# EAGLE design time_circuit_controller_1.1 (EAGLE 9.6.2)

## Sheet 1 of 2
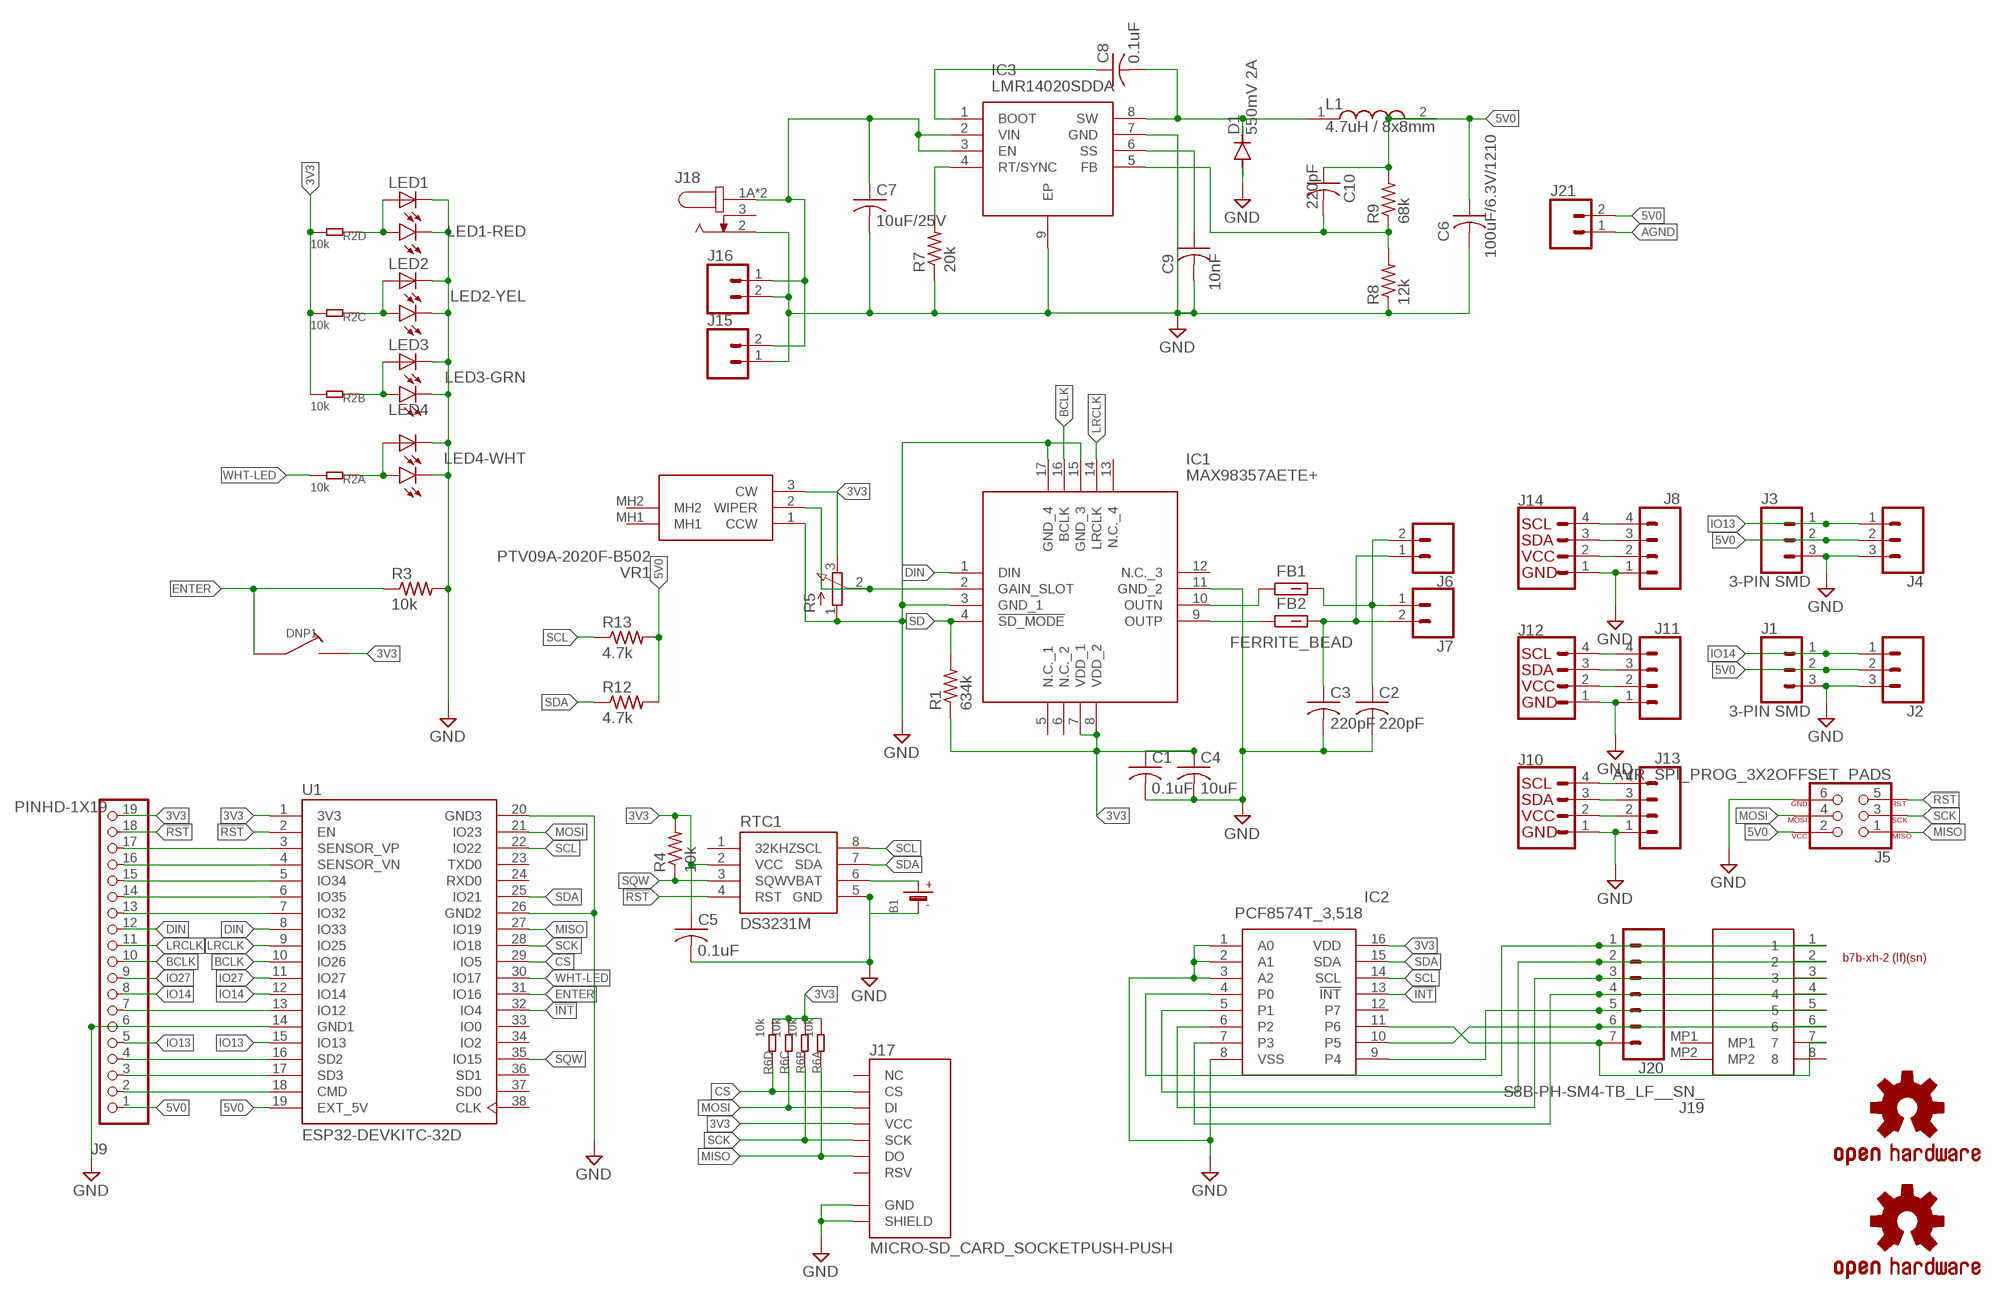
[diagram p0: schematic, sheet 1]

### Parts
B1  BATTERYCR2032_BAT-HLD-001  [CR2032_SMT_BAT-HLD-001]
C1  0.1uF  C-USC0603  [C0603]
C2  220pF  C-USC0603  [C0603]
C3  220pF  C-USC0603  [C0603]
C4  10uF  C-USC0603  [C0603]
C5  0.1uF  C-USC0603  [C0603]
C6  100uF/6.3V/1210  C-USC1210  [C1210]
C7  10uF/25V  C-USC0805  [C0805]
C8  0.1uF  C-USC0603  [C0603]
C9  10nF  C-USC0603  [C0603]
C10  220pF  C-USC0603  [C0603]
D1  550mV 2A  DIODE-DO214AC  [DO214AC]
DNP1  SWITCH-PINHEAD  [PIN-1X2-3.5MM]
FB1  FERRITE_BEAD  FBCHIP-0603(1608-METRIC)  [BEADC1608X95N]
FB2  FERRITE_BEAD  FBCHIP-0603(1608-METRIC)  [BEADC1608X95N]
IC1  MAX98357AETE+  [QFN50P300X300X80-17N]
IC2  PCF8574T_3,518  [SOIC127P1032X265-16N]
IC3  LMR14020SDDA  [SOIC127P600X170-9N]
J1  3-PIN SMD  CONN_03JST-SMD  [JST-3-SMD]
J2  CONN_03LOCK_LONGPADS  [1X03_LOCK_LONGPADS]
J3  3-PIN SMD  CONN_03JST-SMD  [JST-3-SMD]
J4  CONN_03LOCK_LONGPADS  [1X03_LOCK_LONGPADS]
J5  AVR_SPI_PROG_3X2OFFSET_PADS  [2X3_OFFSET]
J6  CONN_02-JST-2MM-SMT  [JST-2-SMD]
J7  CONN_02  [1X02]
J8  CONN_04SMD_2.54  [1X04_5.5MM_STRAIGHT]
J9  PINHD-1X19  [1X19]
J10  I2C_STANDARD  [1X04]
J11  CONN_04SMD_2.54  [1X04_5.5MM_STRAIGHT]
J12  I2C_STANDARD  [1X04]
J13  CONN_04SMD_2.54  [1X04_5.5MM_STRAIGHT]
J14  I2C_STANDARD  [1X04]
J15  CONN_023.5MM  [SCREWTERMINAL-3.5MM-2]
J16  CONN_02-JST-2MM-SMT  [JST-2-SMD]
J17  MICRO-SD_CARD_SOCKETPUSH-PUSH  [MICRO-SD-SOCKET]
J18  9-12VAC  PJ-002AH-SMT-TR  [CUI_PJ-002AH-SMT-TR]
J19  S8B-PH-SM4-TB_LF__SN_  [S8BPHSM4TBLFSN]
J20  CONN_07LOCK  [1X07_LOCK]
J21  CONN_023.5MM  [SCREWTERMINAL-3.5MM-2]
L1  4.7uH / 8x8mm  1273AS-H-3R3N=P3  [INDPM8082X300N]
LED1  LEDCHIPLED_1206  [CHIPLED_1206]
LED1-RED  LED5MM  [LED5MM]
LED2  LEDCHIPLED_1206  [CHIPLED_1206]
LED2-YEL  LED5MM  [LED5MM]
LED3  LEDCHIPLED_1206  [CHIPLED_1206]
LED3-GRN  LED5MM  [LED5MM]
LED4  LEDCHIPLED_1206  [CHIPLED_1206]
LED4-WHT  LED5MM  [LED5MM]
LOGO1  OSHW-LOGOL  [OSHW-LOGO-L]
LOGO2  OSHW-LOGOL  [OSHW-LOGO-L]
R1  634k  R-US_R0603  [R0603]
R2  10k  RES-ARRAY-1206  [RA1206-8]
R3  10k  R-US_R0603  [R0603]
R4  10k  R-US_R0603  [R0603]
R5  3RP/1610N  [3RP/1610N]
R6  10k  RES-ARRAY-1206  [RA1206-8]
R7  20k  R-US_R0603  [R0603]
R8  12k  R-US_R0603  [R0603]
R9  68k  R-US_R0603  [R0603]
R12  4.7k  R-US_R0603  [R0603]
R13  4.7k  R-US_R0603  [R0603]
RTC1  DS3231M  [SO08]
U1  ESP32-DEVKITC-32D  [MODULE_ESP32-DEVKITC-32D]
VR1  PTV09A-2020F-B502  [PTV09A2020FB502]

### Nets
3V3: C1.1 C4.1 C5.1 DNP1.P$2 IC1.7(VDD_1) IC1.8(VDD_2) IC2.16(VDD) J9.19 J17.VCC R1.1 R2.2 R2.3 R2.4 R4.2 R5.3(E) R6.1 R6.2 R6.3 R6.4 RTC1.2(VCC) U1.1(3V3) VR1.3(CW)
5V0: C6.1 C10.1 J1.2 J2.2 J3.2 J4.2 J5.2 J8.2 J9.1 J10.2 J11.2 J12.2 J13.2 J14.2 J21.2 L1.2 R9.2 R12.2 R13.2 U1.19(EXT_5V)
!INT: IC2.13(!INT) U1.32(IO4)
!RST: J5.5 J9.18 RTC1.4(RST) U1.2(EN)
AGND: B1.- C1.2 C2.2 C3.2 C4.2 C5.2 C6.2 C7.2 C9.2 D1.A IC1.3(GND_1) IC1.11(GND_2) IC1.15(GND_3) IC1.17(GND_4) IC2.1(A0) IC2.2(A1) IC2.3(A2) IC2.8(VSS) IC3.7(GND) IC3.9(EP) J1.3 J2.3 J3.3 J4.3 J5.6 J8.1 J9.6 J10.1 J11.1 J12.1 J13.1 J14.1 J15.1 J16.2 J17.CD1(SHIELD) J17.GND J18.2 J21.1 LED1-RED.K(C) LED1.C LED2-YEL.K(C) LED2.C LED3-GRN.K(C) LED3.C LED4-WHT.K(C) LED4.C R3.2 R5.1(A) R7.1 R8.1 RTC1.5(GND) U1.14(GND1) U1.20(GND3) U1.26(GND2) VR1.1(CCW) ; supply symbol labelled GND
BCLK: IC1.16(BCLK) J9.10 U1.10(IO26)
BOOT1: C8.1 IC3.1(BOOT)
CS: J17.CS R6.5 U1.29(IO5)
DIN: IC1.1(DIN) J9.12 U1.8(IO33)
ENTER: DNP1.P$1 R3.1 U1.31(IO16)
FB1: C10.2 IC3.5(FB) R8.2 R9.1
IO13: J3.1 J4.1 J9.5 U1.15(IO13)
IO14: J1.1 J2.1 J9.8 U1.12(IO14)
IO27: J9.9 U1.11(IO27)
LRCLK: IC1.14(LRCLK) J9.11 U1.9(IO25)
MISO: J5.1 J17.DO R6.8 U1.27(IO19)
MOSI: J5.4 J17.DI R6.6 U1.21(IO23)
N$1: IC2.11(P6) J19.7 J20.7
N$2: FB1.1 IC1.10(OUTN)
N$3: B1.+$1(+) B1.+$2(+) RTC1.6(VBAT)
N$4: IC2.4(P0) J19.1 J20.1
N$5: IC2.9(P4) J19.5 J20.5
N$6: J9.15 U1.5(IO34)
N$7: C2.1 FB1.2 J6.2 J7.1
N$8: FB2.1 IC1.9(OUTP)
N$9: C3.1 FB2.2 J6.1 J7.2
N$10: LED1-RED.A LED1.A R2.5
N$11: LED2-YEL.A LED2.A R2.6
N$12: IC2.5(P1) J19.2 J20.2
N$13: LED3-GRN.A LED3.A R2.7
N$14: IC2.6(P2) J19.3 J20.3
N$15: LED4-WHT.A LED4.A R2.8
N$16: IC2.7(P3) J19.4 J20.4
N$17: J9.14 U1.6(IO35)
N$18: IC2.10(P5) J19.6 J20.6
N$19: IC1.2(GAIN_SLOT) R5.2(S) VR1.2(WIPER)
N$20: J9.13 U1.7(IO32)
N$21: J9.16 U1.4(SENSOR_VN)
N$22: J9.17 U1.3(SENSOR_VP)
N$23: J9.7 U1.13(IO12)
N$24: J9.4 U1.16(SD2)
N$25: J9.3 U1.17(SD3)
N$26: J9.2 U1.18(CMD)
RT1: IC3.4(RT/SYNC) R7.2
SCK: J5.3 J17.SCLK(SCK) R6.7 U1.28(IO18)
SCL: IC2.14(SCL) J8.4 J10.4 J11.4 J12.4 J13.4 J14.4 R13.1 RTC1.8(SCL) U1.22(IO22)
SD: IC1.4(!SD_MODE) R1.2
SDA: IC2.15(SDA) J8.3 J10.3 J11.3 J12.3 J13.3 J14.3 R12.1 RTC1.7(SDA) U1.25(IO21)
SQW: R4.1 RTC1.3(SQW) U1.35(IO15)
SS1: C9.1 IC3.6(SS)
SW1: C8.2 D1.C IC3.8(SW) L1.1
VIN1: C7.1 IC3.2(VIN) IC3.3(EN) J15.2 J16.1 J18.1A J18.1B
WHT-LED: R2.1 U1.30(IO17)
Unconnected: IC1.5(N.C._1) IC1.6(N.C._2) IC1.12(N.C._3) IC1.13(N.C._4) IC2.12(P7) J17.RSV1(RSV) J17.RSV2(NC) J18.3 J19.8 J19.MP1 J19.MP2 RTC1.1(32KHZ) U1.23(TXD0) U1.24(RXD0) U1.33(IO0) U1.34(IO2) U1.36(SD1) U1.37(SD0) U1.38(CLK) VR1.MH1 VR1.MH2

### Notes on the sheet
- b7b-xh-2 (lf)(sn)

## Sheet 2 of 2

## Library data of the parts
B1 = Fidget Spinner Example:BATTERY: CR1220 SMT - Digikey: 3001K-ND CD2032 BAT-HLD-001 - Digikey: BAT-HLD-001-ND
C1-C10 = rcl:C-US: CAPACITOR, American symbol; SPICEPREFIX: C
D1 = diode:DIODE-: DIODE
DNP1 = adam - mechanical:SWITCH-PINHEAD
FB1 FB2 = Filter:FB: Ferrite Bead - Generic; CATEGORY: Filter; SUB-CATEGORY: Ferrite bead
IC1 = SamacSys_Parts:MAX98357AETE+: MAXIM INTEGRATED PRODUCTS - MAX98357AETE+ - AMPLIFIER, CLASS-D, 1-CH, 3.2W, TQFN-16 Source: Datasheet; DESCRIPTION: MAXIM INTEGRATED PRODUCTS - MAX98357AETE+ - AMPLIFIER, CLASS-D, 1-CH, 3.2W, TQFN-16; HEIGHT: 0.8mm; MANUFACTURER_NAME: Maxim Integrated; MANUFACTURER_PART_NUMBER: MAX98357AETE+; MOUSER_PART_NUMBER: 700-MAX98357AETE+; MOUSER_PRICE-STOCK: https://www.mouser.co.uk/ProductDetail/Maxim-Integrated/MAX98357AETE%2b?qs=AAveGqk956EyS6m3AmZeuw%3D%3D
IC2 = SamacSys_Parts:PCF8574T_3,518: NXP - PCF8574T/3,518 - IC, I/O EXPANDER, 8BIT, SOIC16 Source: Datasheet; ARROW_PART_NUMBER: PCF8574T/3,518; ARROW_PRICE-STOCK: https://www.arrow.com/en/products/pcf8574t3518/nxp-semiconductors; DESCRIPTION: NXP - PCF8574T/3,518 - IC, I/O EXPANDER, 8BIT, SOIC16; HEIGHT: 2.65mm; MANUFACTURER_NAME: NXP; MANUFACTURER_PART_NUMBER: PCF8574T/3,518; MOUSER_PART_NUMBER: 771-PCF8574TD-T; MOUSER_PRICE-STOCK: https://www.mouser.co.uk/ProductDetail/NXP-Semiconductors/PCF8574T-3518?qs=LOCUfHb8d9srwcgHHpXqQw%3D%3D
IC3 = SamacSys_Parts:LMR14020SDDA: Voltage Regulators - Switching Regulators 40V 2A 2.2Mhz Simple Switcher Source: Datasheet; DESCRIPTION: Voltage Regulators - Switching Regulators 40V 2A 2.2Mhz Simple Switcher; HEIGHT: 1.7mm; MANUFACTURER_NAME: Texas Instruments; MANUFACTURER_PART_NUMBER: LMR14020SDDA; MOUSER_PART_NUMBER: 595-LMR14020SDDA; MOUSER_PRICE-STOCK: https://www.mouser.com/Search/Refine.aspx?Keyword=595-LMR14020SDDA; RS_PART_NUMBER: 1629813; RS_PRICE-STOCK: http://uk.rs-online.com/web/p/products/1629813
J1 J3 = SparkFun-Connectors:CONN_03: Multi connection point. Often used as Generic Header-pin footprint for 0.1 inch spaced/style header connections On any of the 0.1 inch spaced packages, you can populate with these: Break Away Headers - Straight (PRT-00116) Break Away Male Headers - Right Angle (PRT-00553) Female Headers (PRT-00115) Break Away Headers - Machine Pin (PRT-00117) Break Away Female Headers - Swiss Machine Pin (PRT-00743) Stackable Header - 3 Pin (Female, 0.1") (PRT-13875) For SCREWTERMINALS and SPRING TERMINALS visit here: Screw Terimnals on SparkFun.com (5mm/3.5mm/2.54mm spacing) This device is also useful as a general connection point to wire up your design to another part of your project. Our various solder wires solder well into these plated through hole pads. Hook-Up Wire - Assortment (Stranded, 22 AWG) (PRT-11375) Hook-Up Wire - Assortment (Solid Core, 22 AWG) (PRT-11367) View the entire wire category on our website here Special notes: Molex polarized connector foot print use with SKU : PRT-08232 with associated crimp pins and housings.; PROD_ID: CONN-12591
J2 J4 = SparkFun-Connectors:CONN_03: Multi connection point. Often used as Generic Header-pin footprint for 0.1 inch spaced/style header connections On any of the 0.1 inch spaced packages, you can populate with these: Break Away Headers - Straight (PRT-00116) Break Away Male Headers - Right Angle (PRT-00553) Female Headers (PRT-00115) Break Away Headers - Machine Pin (PRT-00117) Break Away Female Headers - Swiss Machine Pin (PRT-00743) Stackable Header - 3 Pin (Female, 0.1") (PRT-13875) For SCREWTERMINALS and SPRING TERMINALS visit here: Screw Terimnals on SparkFun.com (5mm/3.5mm/2.54mm spacing) This device is also useful as a general connection point to wire up your design to another part of your project. Our various solder wires solder well into these plated through hole pads. Hook-Up Wire - Assortment (Stranded, 22 AWG) (PRT-11375) Hook-Up Wire - Assortment (Solid Core, 22 AWG) (PRT-11367) View the entire wire category on our website here Special notes: Molex polarized connector foot print use with SKU : PRT-08232 with associated crimp pins and housings.
J5 = SparkFun-Connectors:AVR_SPI_PROG_3X2: AVR ISP 6 Pin This is the reduced ISP connector for AVR programming. Common on Arduino. This footprint will take up less PCB space and can be used with a 10-pin to 6-pin adapter such as SKU: BOB-08508 **Special note about "TEST_POINT" package. The stop mask is on the top side, so if you want your programming test points to be on the bottom of your board, make sure to place this package on the bottom side of the board. This also ensure that the orientation to program from the bottom side will be correct. SparkFun Products: SparkFun ISP Pogo Adapter - NS Tiny AVR Programmer -PTH
J6 J16 = SparkFun-Connectors:CONN_02: Multi connection point. Often used as Generic Header-pin footprint for 0.1 inch spaced/style header connections On any of the 0.1 inch spaced packages, you can populate with these: Break Away Headers - Straight (PRT-00116) Break Away Male Headers - Right Angle (PRT-00553) Female Headers (PRT-00115) Break Away Headers - Machine Pin (PRT-00117) Break Away Female Headers - Swiss Machine Pin (PRT-00743) For SCREWTERMINALS and SPRING TERMINALS visit here: Screw Terimnals on SparkFun.com (5mm/3.5mm/2.54mm spacing) This device is also useful as a general connection point to wire up your design to another part of your project. Our various solder wires solder well into these plated through hole pads. Hook-Up Wire - Assortment (Stranded, 22 AWG) (PRT-11375) Hook-Up Wire - Assortment (Solid Core, 22 AWG) (PRT-11367) View the entire wire category on our website here Special notes: Molex polarized connector foot print use with: PRT-08233 with associated crimp pins and housings. 2.54_SCREWTERM for use with PRT-10571. 3.5mm Screw Terminal footprints for PRT-08084 5mm Screw Terminal footprints for use with PRT-08432; PROD_ID: CONN-11443
J7 = SparkFun-Connectors:CONN_02: Multi connection point. Often used as Generic Header-pin footprint for 0.1 inch spaced/style header connections On any of the 0.1 inch spaced packages, you can populate with these: Break Away Headers - Straight (PRT-00116) Break Away Male Headers - Right Angle (PRT-00553) Female Headers (PRT-00115) Break Away Headers - Machine Pin (PRT-00117) Break Away Female Headers - Swiss Machine Pin (PRT-00743) For SCREWTERMINALS and SPRING TERMINALS visit here: Screw Terimnals on SparkFun.com (5mm/3.5mm/2.54mm spacing) This device is also useful as a general connection point to wire up your design to another part of your project. Our various solder wires solder well into these plated through hole pads. Hook-Up Wire - Assortment (Stranded, 22 AWG) (PRT-11375) Hook-Up Wire - Assortment (Solid Core, 22 AWG) (PRT-11367) View the entire wire category on our website here Special notes: Molex polarized connector foot print use with: PRT-08233 with associated crimp pins and housings. 2.54_SCREWTERM for use with PRT-10571. 3.5mm Screw Terminal footprints for PRT-08084 5mm Screw Terminal footprints for use with PRT-08432
J8 J11 J13 = SparkFun-Connectors:CONN_04: Multi connection point. Often used as Generic Header-pin footprint for 0.1 inch spaced/style header connections On any of the 0.1 inch spaced packages, you can populate with these: Break Away Headers - Straight (PRT-00116) Break Away Male Headers - Right Angle (PRT-00553) Female Headers (PRT-00115) Break Away Headers - Machine Pin (PRT-00117) Break Away Female Headers - Swiss Machine Pin (PRT-00743) For SCREWTERMINALS and SPRING TERMINALS visit here: Screw Terimnals on SparkFun.com (5mm/3.5mm/2.54mm spacing) This device is also useful as a general connection point to wire up your design to another part of your project. Our various solder wires solder well into these plated through hole pads. Hook-Up Wire - Assortment (Stranded, 22 AWG) (PRT-11375) Hook-Up Wire - Assortment (Solid Core, 22 AWG) (PRT-11367) View the entire wire category on our website here Special notes: Molex polarized connector foot print use with SKU : PRT-08231 with associated crimp pins and housings. 1MM SMD Version SKU: PRT-10208
J9 = adafruit:PINHD-1X19
J10 J12 J14 = SparkFun-Connectors:I2C_STANDARD: SparkFun I2C Standard Pinout Header SparkFun has standardized on a pinout for all I2C based sensor breakouts. This pinout allows I2C boards to be plugged directly into the headers on Arduino Uno compatible boards, and to be daisy chained easily. Example SparkFun Products: SparkFun Atmospheric Sensor Breakout - BME280 <https://www.sparkfun.com/products/13676> SparkFun Altitude/Pressure Sensor Breakout - MPL3115A2 <https://www.sparkfun.com/products/11084> SparkFun TOF Range Finder Sensor - VL6180 <https://www.sparkfun.com/products/12785>
J15 J21 = SparkFun-Connectors:CONN_02: Multi connection point. Often used as Generic Header-pin footprint for 0.1 inch spaced/style header connections On any of the 0.1 inch spaced packages, you can populate with these: Break Away Headers - Straight (PRT-00116) Break Away Male Headers - Right Angle (PRT-00553) Female Headers (PRT-00115) Break Away Headers - Machine Pin (PRT-00117) Break Away Female Headers - Swiss Machine Pin (PRT-00743) For SCREWTERMINALS and SPRING TERMINALS visit here: Screw Terimnals on SparkFun.com (5mm/3.5mm/2.54mm spacing) This device is also useful as a general connection point to wire up your design to another part of your project. Our various solder wires solder well into these plated through hole pads. Hook-Up Wire - Assortment (Stranded, 22 AWG) (PRT-11375) Hook-Up Wire - Assortment (Solid Core, 22 AWG) (PRT-11367) View the entire wire category on our website here Special notes: Molex polarized connector foot print use with: PRT-08233 with associated crimp pins and housings. 2.54_SCREWTERM for use with PRT-10571. 3.5mm Screw Terminal footprints for PRT-08084 5mm Screw Terminal footprints for use with PRT-08432; PROD_ID: CONN-08399
J17 = SparkFun-Connectors:MICRO-SD_CARD_SOCKET: microSD Socket for Transflash Push-push type µSD socket. tDoc lines correctly indicate media card edge positions when inserting (unlocked, locked, depressed). NOTE: CD1 and CD2 are connected internally, and the default detect state of the socket is detect pin to ground. SparkFun Products: WAV Trigger <https://www.sparkfun.com/products/13660> CAN-Bus Shield <https://www.sparkfun.com/products/13262> SparkFun Level Shifing microSD Breakout <https://www.sparkfun.com/products/13743>; PROD_ID: CONN-07820
J18 = PJ-002AH-SMT-TR:PJ-002AH-SMT-TR: 2.0 mm Center Pin, 5.0 A, Right Angle, Surface Mount (SMT), Dc Power Jack Connector; AVAILABILITY: Good; DESCRIPTION: 24 VDC 5 A Surface Mount Unshielded 2 Conductors 3 Contacts Male Power Jack; MF: CUI; MP: PJ-002AH-SMT-TR; PACKAGE: None; PRICE: 0.88 USD
J19 = SamacSys_Parts:S8B-PH-SM4-TB_LF__SN_: Conn Shrouded Header (4 Sides) HDR 8 POS 2mm Solder RA Side Entry SMD T/R Source: Datasheet; ARROW_PART_NUMBER: S8B-PH-SM4-TB(LF)(SN); ARROW_PRICE-STOCK: https://www.arrow.com/en/products/s8b-ph-sm4-tb-lf-sn/jst-manufacturing; DESCRIPTION: Conn Shrouded Header (4 Sides) HDR 8 POS 2mm Solder RA Side Entry SMD T/R; HEIGHT: 5.5mm; MANUFACTURER_NAME: JST (JAPAN SOLDERLESS TERMINALS); MANUFACTURER_PART_NUMBER: S8B-PH-SM4-TB(LF)(SN)
J20 = SparkFun-Connectors:CONN_07: Multi connection point. Often used as Generic Header-pin footprint for 0.1 inch spaced/style header connections On any of the 0.1 inch spaced packages, you can populate with these: Break Away Headers - Straight (PRT-00116) Break Away Male Headers - Right Angle (PRT-00553) Female Headers (PRT-00115) Break Away Headers - Machine Pin (PRT-00117) Break Away Female Headers - Swiss Machine Pin (PRT-00743) For SCREWTERMINALS and SPRING TERMINALS visit here: Screw Terimnals on SparkFun.com (5mm/3.5mm/2.54mm spacing) This device is also useful as a general connection point to wire up your design to another part of your project. Our various solder wires solder well into these plated through hole pads. Hook-Up Wire - Assortment (Stranded, 22 AWG) (PRT-11375) Hook-Up Wire - Assortment (Solid Core, 22 AWG) (PRT-11367) View the entire wire category on our website here Special notes: Molex polarized connector foot print use with SKU : PRT-08231 with associated crimp pins and housings. 1MM SMD Version SKU: PRT-10208 NOTES ON THE VARIANTS LOCK and LOCK_LONGPADS... This footprint was designed to help hold the alignment of a through-hole component (i.e. 6-pin header) while soldering it into place. You may notice that each hole has been shifted either up or down by 0.005 of an inch from it's more standard position (which is a perfectly straight line). This slight alteration caused the pins (the squares in the middle) to touch the edges of the holes. Because they are alternating, it causes a "brace" to hold the component in place. 0.005 has proven to be the perfect amount of "off-center" position when using our standard breakaway headers. Although looks a little odd when you look at the bare footprint, once you have a header in there, the alteration is very hard to notice. Also,if you push a header all the way into place, it is covered up entirely on the bottom side.
L1 = SamacSys_Parts:1273AS-H-3R3N=P3: Inductor Power Shielded Wirewound 3.3uH 30% 100KHz Ferrite 5.4A 19.2mOhm DCR 3131 T/R Source: Datasheet; DESCRIPTION: Inductor Power Shielded Wirewound 3.3uH 30% 100KHz Ferrite 5.4A 19.2mOhm DCR 3131 T/R; HEIGHT: 3mm; MANUFACTURER_NAME: Murata Electronics; MANUFACTURER_PART_NUMBER: 1273AS-H-3R3N=P3
LED1-LED4 = adafruit:LED: LED
LED1-RED LED2-YEL LED3-GRN LED4-WHT = led:LED: LED
LOGO1 LOGO2 = SparkFun-Aesthetics:OSHW-LOGO: Open-Source Hardware (OSHW) Logo This logo indicates the piece of hardware it is found on incorporates a OSHW license and/or adheres to the definition of open source hardware found here: http://freedomdefined.org/OSHW
R1 R3 R4 R7-R9 R12 R13 = rcl:R-US_: RESISTOR, American symbol; SPICEPREFIX: R
R2 R6 = cap-array:RES-ARRAY: Resistor Array
R5 = pot:3RP/1610N: 16mm Potentiometer one level Source: http://www.alphapotentiometers.net/html/16mm_pot_2.html
RTC1 = SparkFun-Clocks:DS3231M: DS3231M Real Time Clock Accuracy +/-5ppm. Battery Backup. 2.3V to 5.5V. Datasheet SparkFun Products CryptoCape (DEV-12773) SparkFun CryptoShield (DEV-13183); PROD_ID: IC-11985
U1 = ESP32-DEVKITC-32D:ESP32-DEVKITC-32D: Eval Board For Esp-Wroom-32; AVAILABILITY: Unavailable; DESCRIPTION: Eval Board For Esp-Wroom-32; MF: Espressif Systems; MP: ESP32-DEVKITC-32D; PACKAGE: None; PRICE: None
VR1 = SamacSys_Parts:PTV09A-2020F-B502: Potentiometers Source: Datasheet; ARROW_PART_NUMBER: PTV09A-2020F-B502; ARROW_PRICE-STOCK: https://www.arrow.com/en/products/ptv09a-2020f-b502/bourns; DESCRIPTION: Potentiometers; HEIGHT: 15.5mm; MANUFACTURER_NAME: Bourns; MANUFACTURER_PART_NUMBER: PTV09A-2020F-B502; MOUSER_PART_NUMBER: 652-PTV09A-2020FB502; MOUSER_PRICE-STOCK: https://www.mouser.co.uk/ProductDetail/Bourns/PTV09A-2020F-B502?qs=Qzws7J6gxqzi90bdboMV5Q%3D%3D

## Net classes
0 default: width 0.152 mm, drill 0.33 mm, clearance 0.152 mm
1 pwr: width 0.305 mm, drill 0.356 mm, clearance 0.152 mm

## Board
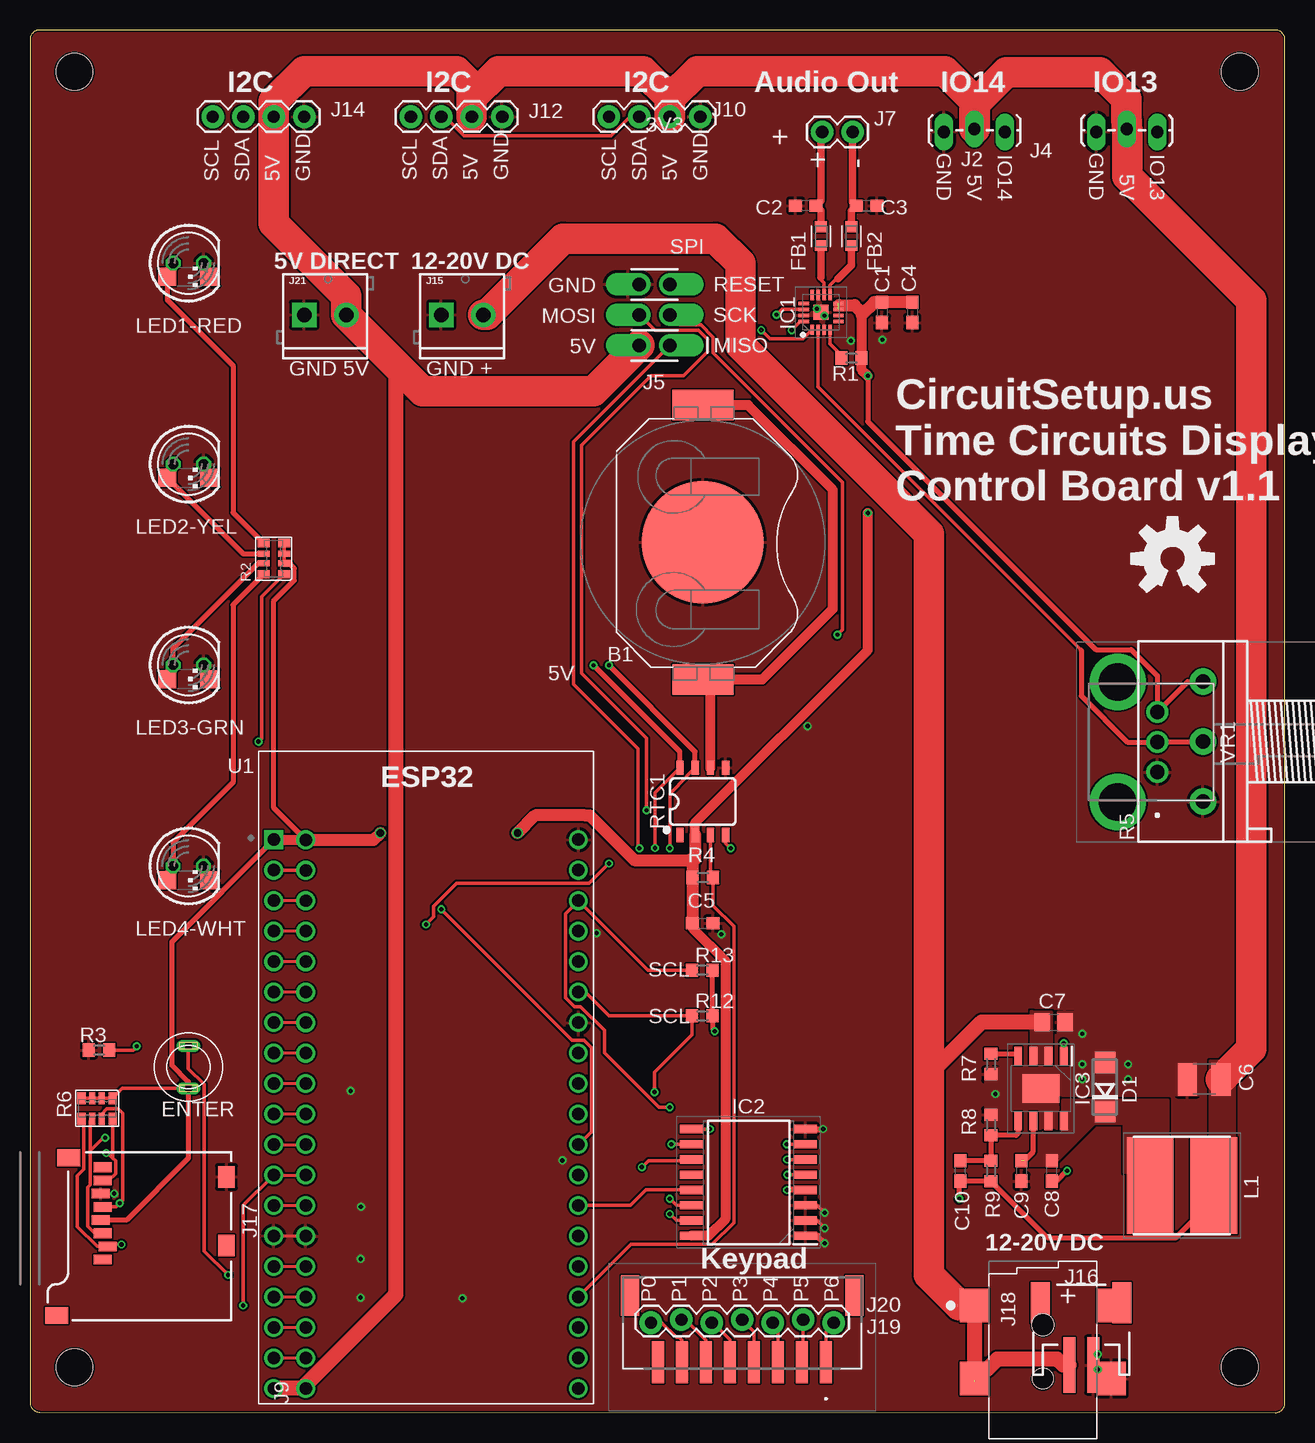
[diagram p1: board, top side]
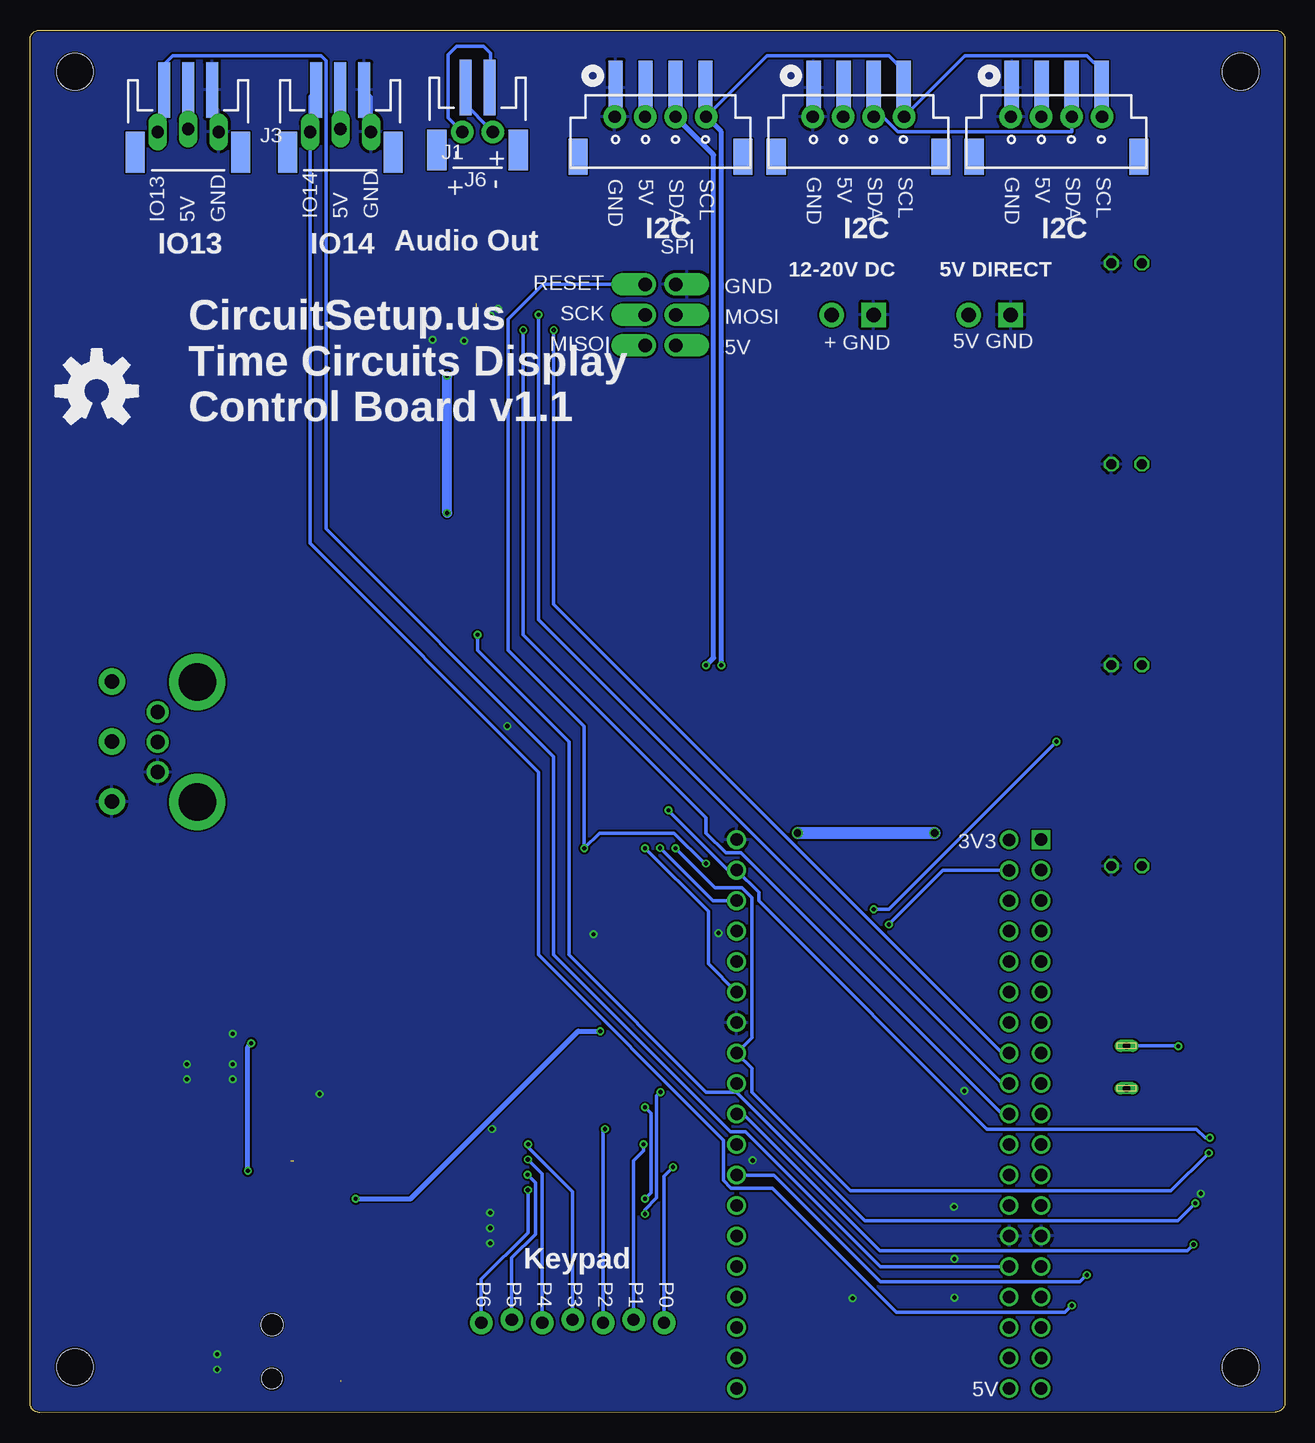
[diagram p2: board, bottom side, seen from below]

Size 104.62 x 115.22 mm. Coordinates in mm from the lower left corner, seen from the top.
Outline: 103.82,0 arc90 104.62,0.8 104.62,28.77 104.62,30.78 104.6,105.68 104.62,109.74 104.62,114.42 arc90 103.82,115.22 0.8,115.22 arc90 0,114.42 0,0.84 arc90 0.8,0.04 103.82,0
Copper layers (1*16): Top 0.035mm / dielectric 1.5mm / Bottom 0.035mm
Design rules "default *": minimum track width 6mil, minimum drill 0.35mm, track to track 6mil, track to pad 6mil, pad to pad 6mil, via to via 6mil, smd to smd 0mil, copper to edge 6mil, drill to drill 6mil, minimum pad ring 8mil, minimum via ring 6mil, stop-mask expansion 4mil, vias tented up to drill 25mil, thermal gap 10mil
Holes 3.05 mm at 3.71,111.75 100.86,111.75 100.86,3.8 3.71,3.78

### Footprints (pad centres in the part's own frame; a part is rotated, then mirrored left to right if it is on the bottom)
CR2032_SMT_BAT-HLD-001 = smd 2.54 x 5.08: +$1 -11.43,0; +$2 11.43,0 | smd 10.16 x 10.16: - 0,0
C0603 = smd 1.1 x 1: 1 -0.85,0; 2 0.85,0
C1210 = smd 1.6 x 2.7: 1 -1.4,0; 2 1.4,0
C0805 = smd 1.3 x 1.5: 1 -0.95,0; 2 0.95,0
DO214AC = smd 1.8 x 1.7: A 2.05,0; C -2.05,0
PIN-1X2-3.5MM = drill 0.6 long: P$1 -1.778,0; P$2 1.778,0
BEADC1608X95N = smd 0.9 x 0.97: 1 -0.785,0 | smd 0.933 x 0.97: 2 0.769,0
QFN50P300X300X80-17N = smd 0.85 x 0.3: 1 -1.45,0.75; 2 -1.45,0.25; 3 -1.45,-0.25; 4 -1.45,-0.75; 9 1.45,-0.75; 10 1.45,-0.25; 11 1.45,0.25; 12 1.45,0.75 | smd 0.3 x 0.85: 5 -0.75,-1.45; 6 -0.25,-1.45; 7 0.25,-1.45; 8 0.75,-1.45; 13 0.75,1.45; 14 0.25,1.45; 15 -0.25,1.45; 16 -0.75,1.45 | smd 1.25 x 1.25: 17 0,0
SOIC127P1032X265-16N = smd 1.95 x 0.7: 1 -4.725,4.445; 2 -4.725,3.175; 3 -4.725,1.905; 4 -4.725,0.635; 5 -4.725,-0.635; 6 -4.725,-1.905; 7 -4.725,-3.175; 8 -4.725,-4.445; 9 4.725,-4.445; 10 4.725,-3.175; 11 4.725,-1.905; 12 4.725,-0.635; 13 4.725,0.635; 14 4.725,1.905; 15 4.725,3.175; 16 4.725,4.445
SOIC127P600X170-9N = smd 1.525 x 0.65: 1 -2.712,1.905; 2 -2.712,0.635; 3 -2.712,-0.635; 4 -2.712,-1.905; 5 2.712,-1.905; 6 2.712,-0.635; 7 2.712,0.635; 8 2.712,1.905 | smd 2.4 x 3.1: 9 0,0
JST-3-SMD = smd 1 x 4.6: 1 2.01,-4.77; 2 0.01,-4.77; 3 -1.99,-4.77 | smd 1.6 x 3.4: NC1 -4.39,0.43; NC2 4.41,0.43
1X03_LOCK_LONGPADS = drill 1.016 long: 1 0,0; 2 2.54,-0.254; 3 5.08,0
2X3_OFFSET = drill 1.118 pad 1.88 offset: 1 -2.54,-1.27; 2 -2.54,1.27; 3 0,-1.27; 4 0,1.27; 5 2.54,-1.27; 6 2.54,1.27
JST-2-SMD = smd 1 x 4.6: 1 -1,-3.7; 2 1,-3.7 | smd 1.6 x 3.4: NC1 -3.4,1.5; NC2 3.4,1.5
1X02 = drill 1.016 pad 1.88: 1 0,0; 2 2.54,0
1X04_5.5MM_STRAIGHT = smd 1.2 x 4.5: 1 -3.737,3.688; 2 -1.238,3.688; 3 1.262,3.688; 4 3.763,3.688 | smd 1.6 x 3: NC1 -6.862,-2.062; NC2 6.875,-2.062
1X19 = drill 1.04: 1 0,0; 2 2.54,0; 3 5.08,0; 4 7.62,0; 5 10.16,0; 6 12.7,0; 7 15.24,0; 8 17.78,0; 9 20.32,0; 10 22.86,0; 11 25.4,0; 12 27.94,0; 13 30.48,0; 14 33.02,0; 15 35.56,0; 16 38.1,0; 17 40.64,0; 18 43.18,0; 19 45.72,0
1X04 = drill 1.016 pad 1.88: 1 0,0; 2 2.54,0; 3 5.08,0; 4 7.62,0
SCREWTERMINAL-3.5MM-2 = drill 1.2 pad 2.032 square: 1 0,0 | drill 1.2 pad 2.032: 2 3.5,0
MICRO-SD-SOCKET = smd 1.8 x 1.4: CD1 -2.05,0.4; CD2 -7.75,0.4 | smd 0.8 x 1.5: CS -7.84,10.3; DI -6.74,10.7; DO -2.34,10.7; GND -3.44,10.9; RSV1 -8.94,10.7; RSV2 -1.24,10.7; SCLK -4.54,10.7; VCC -5.64,10.9 | smd 1.4 x 1.9: GND1 -13.6,14.55; GND3 -0.45,13.55
CUI_PJ-002AH-SMT-TR = smd 2.8 x 2.4: 1A 0,0; 1B -6.1,0; 2 -6.1,-11.4; 3 0,-11.4 | hole 1.7: -6.1,-5.7 | hole 1.8: -1.6,-5.7
S8BPHSM4TBLFSN = smd 1 x 3.5: 1 7,-3.25; 2 5,-3.25; 3 3,-3.25; 4 1,-3.25; 5 -1,-3.25; 6 -3,-3.25; 7 -5,-3.25; 8 -7,-3.25 | smd 1.5 x 3.4: MP1 9.35,2.3; MP2 -9.35,2.3
1X07_LOCK = drill 1.016 pad 1.88: 1 0,0.127; 2 2.54,-0.127; 3 5.08,0.127; 4 7.62,-0.127; 5 10.16,0.127; 6 12.7,-0.127; 7 15.24,0.127
INDPM8082X300N = smd 3.9 x 8.05: 1 -2.65,0; 2 2.65,0
CHIPLED_1206 = smd 1.5 x 1.5: A 0,-1.75; C 0,1.75
LED5MM = drill 0.813 octagon: A -1.27,0; K 1.27,0
R0603 = smd 1 x 1.1: 1 -0.85,0; 2 0.85,0
RA1206-8 = smd 0.7 x 1: 1 -1.3,-0.85; 4 1.3,-0.85; 5 1.3,0.85; 8 -1.3,0.85 | smd 0.5 x 1: 2 -0.4,-0.85; 3 0.4,-0.85; 6 0.4,0.85; 7 -0.4,0.85
3RP/1610N = drill 1.2 pad 2.184: 1 -5,0; 2 0,0; 3 5,0
SO08 = smd 0.6 x 1.2: 1 -1.905,-2.8; 2 -0.635,-2.8; 3 0.635,-2.8; 4 1.905,-2.8; 5 1.905,2.8; 6 0.635,2.8; 7 -0.635,2.8; 8 -1.905,2.8
MODULE_ESP32-DEVKITC-32D = drill 1.04 square: 1 -12.7,19.76 | drill 1.04: 2 -12.7,17.22; 3 -12.7,14.68; 4 -12.7,12.14; 5 -12.7,9.6; 6 -12.7,7.06; 7 -12.7,4.52; 8 -12.7,1.98; 9 -12.7,-0.56; 10 -12.7,-3.1; 11 -12.7,-5.64; 12 -12.7,-8.18; 13 -12.7,-10.72; 14 -12.7,-13.26; 15 -12.7,-15.8; 16 -12.7,-18.34; 17 -12.7,-20.88; 18 -12.7,-23.42; 19 -12.7,-25.96; 20 12.7,19.76; 21 12.7,17.22; 22 12.7,14.68; 23 12.7,12.14; 24 12.7,9.6; 25 12.7,7.06; 26 12.7,4.52; 27 12.7,1.98; 28 12.7,-0.56; 29 12.7,-3.1; 30 12.7,-5.64; 31 12.7,-8.18; 32 12.7,-10.72; 33 12.7,-13.26; 34 12.7,-15.8; 35 12.7,-18.34; 36 12.7,-20.88; 37 12.7,-23.42; 38 12.7,-25.96
PTV09A2020FB502 = drill 1.2 pad 1.8: 1 0,0; 2 2.5,0; 3 5,0 | drill 3.12 pad 4.68: MH1 -2.5,3.3; MH2 7.5,3.3

### Placement (x,y rotation side)
B1  56.09,72.53 90 top
C1  71.02,91.69 270 top
C2  64.67,100.58 180 top
C3  69.75,100.58 0 top
C4  73.56,91.69 270 top
C5  56.09,40.78 0 top
C6  97.89,27.77 180 top
C7  85.34,32.55 0 top
C8  85.19,20.15 90 top
C9  82.65,20.15 270 top
C10  77.57,20.15 90 top
D1  89.63,27.14 90 top
DNP1  13.21,28.8 270 top
FB1  65.94,98.04 90 top
FB2  68.48,98.04 90 top
IC1  65.94,91.69 90 top
IC2  59.9,19.19 180 top
IC3  84.27,27.01 270 top
J1  78.74,105.45 180 bottom
J2  81.28,106.72 180 top
J3  91.44,105.45 180 bottom
J4  93.98,106.72 180 top
J5  52.07,91.48 90 top
J6  67.31,106.72 180 bottom
J7  66.04,106.72 0 top
J8  52.07,106.72 0 bottom
J9  22.99,2.02 90 top
J10  55.88,107.99 180 top
J11  35.56,106.72 0 bottom
J12  39.37,107.99 180 top
J13  19.05,106.72 0 bottom
J14  22.86,107.99 180 top
J15  34.29,91.48 0 top
J16  87.63,7.66 0 top
J17  16.78,21.69 90 top
J18  78.74,8.93 90 top
J19  59.37,7.46 0 top
J20  67,7.62 180 top
J21  22.86,91.48 0 top
L1  96.03,18.93 0 top
LED1  13.21,94.66 270 top
LED1-RED  13.21,95.79 0 top
LED2  13.21,77.89 270 top
LED2-YEL  13.21,79.04 0 top
LED3  13.21,61.13 270 top
LED3-GRN  13.21,62.3 0 top
LED4  13.21,44.37 270 top
LED4-WHT  13.2,45.55 0 top
LOGO1  95.25,71.16 0 top
LOGO2  99.06,85.13 0 bottom
R1  68.48,87.88 180 top
R2  20.32,71.16 90 top
R3  5.76,30.22 180 top
R4  56.09,44.59 180 top
R5  97.79,55.92 90 top
R6  5.59,25.35 180 top
R7  80.11,29.04 90 top
R8  80.11,23.96 270 top
R9  80.11,20.15 270 top
R12  56.06,33.06 0 top
R13  56.06,36.87 0 top
RTC1  56.09,50.94 0 top
U1  33.02,27.98 0 top
VR1  93.98,53.38 90 top

### Tracks (layer width: path | path; a pad name or v marks a point on that pad's centre or on a via)
3V3  (via drill 0.35, 0.6)  (1 unrouted)
  Top 0.305: R6.4 R6.3 R6.2 R6.1 7.71,27.02 DNP1.P$2 | U1.1 | R2.2 R2.3 R2.4 | IC1.7 IC1.8
  Top 0.406: IC1.8 67.45,92.39 67.45,92.29 | U1.1 16.06,43.49 16.06,43.47 11.85,39.25 11.85,28.95 13.21,27.59 DNP1.P$2 13.21,21.21 8.04,16.05 J17.VCC | J9.19 20.32,50.4 20.32,67.66 22.03,69.37 22.03,70.36 21.82,70.57 21.78,70.57 21.59,70.76 | v69.85,86.4 69.85,82.59 88.86,63.58 91.8,63.58 93.98,61.39 VR1.3 96.52,60.92 R5.3
  Top 0.61: 21.59,70.76 R2.2
  Top 0.813: U1.1 J9.19 23.06,47.81 | IC2.16 56.58,14.74 57.97,16.13 57.97,37.65 55.24,40.38 C5.1 | RTC1.2 55.46,49.15 69.85,63.54 v69.85,74.97 | 69.33,91.69 69.33,91.48 R1.1 69.33,86.92 v69.85,86.4
  Top 1.016: RTC1.2 55.46,46.07 | 55.46,46.07 55.24,45.86 R4.2 C5.1 | C4.1 C1.1 70.39,92.54 69.33,91.48 | 69.33,91.69 68.74,92.29 67.45,92.29 | 55.46,46.07 55.05,46.07 55.02,46.04 50.39,46.04 46.66,49.78 46.27,49.78 42.12,49.78 v40.64,48.3 | J9.19 28.64,47.74 v29.21,48.3
  Bottom 0.813: v69.85,74.97 v69.85,86.4
  Bottom 1.016: v29.21,48.3 v40.64,48.3
5V0  (via drill 0.35)
  Top 0.406: R13.2 R12.2 56.91,31.97 v57.08,31.79 | v77.47,17.82 77.47,19.2 C10.1 R9.2 84.86,14.55 95.48,14.55 98.68,17.75 98.68,18.09
  Top 1.27: U1.19 J9.1 22.99,2.34 30.5,9.86 30.5,86.43 30.96,86.88
  Top 2.54: L1.2 98.68,18.09 | C6.1 101.83,30.31 101.83,92.69 91.46,103.05 91.46,106.95 J4.2 91.44,107.64 91.41,107.66 91.41,109.48 89.19,111.7 81.39,111.7 78.74,109.05 J2.2 78.76,107 78.76,109.3 76.27,111.8 55.64,111.8 53.31,109.48 53.31,108.02 J10.2 53.34,109.58 51.12,111.8 39.05,111.8 36.83,109.58 J12.2 36.83,110.53 35.56,111.8 22.86,111.8 20.32,109.26 J14.2 20.32,99.1 26.36,93.06 J21.2 30.96,86.88 32.71,85.13 46.99,85.13 J5.2
  Bottom 0.305: J2.2 J1.2 | J4.2 J3.2 | J14.2 20.32,110.38 J13.2
  Bottom 0.406: v57.08,31.79 58.93,31.79 72.9,17.82 v77.47,17.82 | J12.2 36.8,108.03 J11.2 | J10.2 53.31,108.03 J8.2
  pour Top (no thermals): 100.38,20.1 100.38,29.3 98.39,29.3 98.39,20.1
!INT
  Top 0.305: U1.32 50.07,17.26 51.37,18.55 IC2.13
!RST  (via drill 0.35)
  Top 0.305: U1.2 J9.18 | v58.42,47.03 58,47.46 RTC1.4 | v33.02,40.68 33.66,41.32 33.66,42.21 35.56,44.12 46.61,44.12 v48.26,45.76
  Bottom 0.305: J5.5 61.85,94.02 64.77,91.11 64.77,63.54 58.42,57.19 v58.42,47.03 57.15,48.3 50.93,48.3 48.39,45.76 v48.26,45.76 | J9.18 28.5,45.2 v33.02,40.68
AGND  (via drill 0.35, 0.36)
  Top 0.254: J9.6 U1.14
  Top 0.305: v66.25,16.65 65.62,17.28 IC2.3 | v66.25,15.38 65.62,16.01 IC2.2
  Top 0.508: v66.25,14.11 65.62,14.74 IC2.1 | IC2.8 v66.12,23.63
  Bottom 0.305: J2.3 76.2,109.67 J1.3 | J4.3 88.9,107.13 89.45,107.68 J3.3
  other vias: 91.54,29.04 87.73,29.04 87.73,31.58 91.54,27.77 87.73,27.77 80.49,26.55 89.03,4.87 89.03,3.6 7.01,18.25 57.63,39.87 65.61,91.99 66.22,91.41 68.43,89.32 71.07,89.4 27.59,17.16 27.57,9.59 26.73,26.81 64.83,57.21 44.38,21.02 47.23,39.97 27.57,12.81 36.05,9.54
  pour Top (no thermals): 89.25,29.91 89.25,33.36 85.75,33.36 85.75,31.38 87.07,31.38 87.07,29.85 89.2,29.85
  pour Top (no thermals): 97.84,31 97.84,26.5 85.64,26.5 85.64,23.78 79.7,23.78 79.7,28.69 87.12,28.69 87.12,31
  pour Top (rank 2): 107.95,118.15 107.95,-1.23 -1.27,-1.23 -1.27,118.15
  pour Bottom: -2.54,118.15 -2.54,-2.5 105.41,-2.5 105.41,118.15
BCLK  (via drill 0.35)
  Top 0.254: J9.10 U1.10
  Top 0.305: v63.5,90.21 64.23,90.94 IC1.16
  Bottom 0.305: J9.10 23.56,24.88 45.34,46.66 46.61,46.66 48.26,48.3 48.26,49.57 63.5,64.81 v63.5,90.21
BOOT1  (via drill 0.36)
  Top 0.406: IC3.1 v86.18,30.78 | C8.1 85.59,19.3 86.44,20.15 v86.46,20.15
  Bottom 0.406: v86.18,30.78 86.36,30.6 86.38,30.62 86.46,30.46 v86.46,20.15
CS  (via drill 0.35)
  Top 0.305: R6.5 4.49,24.31 4.49,20.28 3.94,19.74 3.94,15.51 5.6,13.85 J17.CS 6.64,14.01 v7.62,14.01
  Bottom 0.305: v7.62,14.01 8.15,13.48 33.76,13.48 45.16,24.88 U1.29
DIN  (via drill 0.35)  (1 unrouted)
  Top 0.254: J9.12 U1.8
  Top 0.305: v60.96,90.21 61.67,89.5 64.46,89.5 64.46,89.51 IC1.1
  Bottom 0.305: J9.12 23.56,29.96 60.96,67.35 v60.96,90.21
ENTER  (via drill 0.35)
  Top 0.305: v8.89,30.52 8.58,30.22 R3.1 | DNP1.P$1 13.21,28.66 14.52,27.35 14.52,13.46 v16.51,11.47
  Bottom 0.305: v8.89,30.52 8.94,30.57 DNP1.P$1 | v16.51,11.47 17.09,10.89 33.71,10.89 42.62,19.8 U1.31
FB1
  Top 0.406: IC3.5 82.37,23.28 82.2,23.11 R8.2 R9.1 C10.2
IO13
  Top 0.254: J9.5 U1.15
  Bottom 0.305: J9.5 33.72,12.18 44.97,23.43 46.24,23.43 60.96,38.14 60.96,54.65 79.94,73.64 79.94,112.65 80.37,113.07 92.71,113.07 93.47,112.31 93.47,109.28 93.45,109.26
  Bottom 0.406: J4.1 93.45,107.25 93.45,109.26 J3.1
IO14  (via drill 0.35)
  Top 0.254: J9.8 U1.12
  Top 0.305: v17.78,8.93 17.78,17.26 U1.12
  Bottom 0.305: J1.1 81.28,109.69 J2.1 81.28,72.43 62.23,53.38 62.23,38.14 46.8,22.72 46.8,19.35 46.17,18.72 42.74,18.72 32.4,8.37 18.34,8.37 v17.78,8.93
IO27
  Top 0.254: J9.9 U1.11
LRCLK  (via drill 0.35)
  Top 0.254: J9.11 U1.9
  Top 0.305: v62.23,91.48 62.69,91.94 IC1.14
  Bottom 0.305: J9.11 23.56,27.42 62.23,66.08 v62.23,91.48
MISO  (via drill 0.35)
  Top 0.305: J17.DO 6.56,19.35 7.14,19.92 7.14,20.98 6.89,21.22 | R6.8 6.89,21.22 | v6.35,21.63 6.48,21.63 6.89,21.22 | J5.1 45.32,80.92 45.32,60.71 50.7,55.33 50.7,47.13 v50.8,47.03
  Bottom 0.305: v6.35,21.63 9.5,18.48 36.22,18.48 44.45,26.71 44.45,28.69 U1.27 44.45,31.23 44.45,42.93 45.27,43.75 47.51,43.75 v50.8,47.03
MOSI  (via drill 0.35)
  Top 0.305: R6.6 5.03,24.34 5.03,21.83 | 5.03,21.83 5.03,18.98 4.83,18.78 4.83,15.52 5.4,14.95 J17.DI | v6.26,22.9 6.09,22.9 5.03,21.83 | v51.38,50.21 51.38,56.2 45.98,61.6 45.98,80.63 51.78,86.43 54.46,86.43 56.46,88.43 56.46,89.46 55.73,90.19 52.09,90.19 J5.4
  Bottom 0.305: v6.26,22.9 6.65,22.9 7.37,23.63 24.86,23.63 43.87,42.64 43.87,43.35 U1.21 46.43,45.2 51.38,50.16 v51.38,50.21
N$1  (via drill 0.36)
  Top 0.305: 55.08,20.99 51.55,20.99 v51.01,20.46 | J20.7 52.65,7.49 53.88,6.27 54.12,6.27 54.37,6.01 J19.7
  Top 0.508: IC2.11 55.08,20.99
  Bottom 0.305: v51.01,20.46 51.76,19.71 J20.7
N$2
  Top 0.305: IC1.10 66.19,94.16 65.94,94.41 65.94,94.61
  Top 0.61: 65.94,94.61 FB1.1
N$3
  Top 0.813: RTC1.6 56.73,60.46 B1.+$1 61.06,61.1 66.93,66.97 66.93,76.89 59.86,83.96 B1.+$2
N$4  (via drill 0.36)
  Top 0.305: J20.1 67,7.35 66.36,6.71 J19.1
  Top 0.508: IC2.4 v63.12,18.55
  Bottom 0.305: J20.1 67,11.11 63.12,14.99 v63.12,18.55
N$5  (via drill 0.36)
  Top 0.305: IC2.9 v56.68,23.63 | J20.5 56.94,7.49 58.37,6.06 J19.5
  Bottom 0.305: J20.5 56.84,23.48 v56.68,23.63
N$6
  Top 0.254: J9.15 U1.5
N$7
  Top 0.61: FB1.2 65.94,100.16 C2.1 65.92,100.98 65.92,106.61 J7.1
  Bottom 0.305: J7.1 68.58,109.26 68.58,110.15 J6.2
N$8
  Top 0.305: IC1.9 66.69,93.97 67.21,94.49 67.34,94.49
  Top 0.61: 67.34,94.49 68.48,95.63 FB2.1
N$9
  Top 0.61: FB2.2 68.48,100.16 C3.1 68.58,100.91 J7.2
  Bottom 0.305: J7.2 69.77,107.92 69.77,113.15 69.06,113.86 66.83,113.86 66.24,113.28 66.24,109.47 66.31,109.53 J6.1
N$10
  Top 0.406: LED1-RED.A 11.46,95.31 LED1.A 11.46,92.72 16.93,87.25 16.93,75 R2.5
N$11
  Top 0.406: LED2-YEL.A 11.46,78.56 LED2.A 17.79,71.56 R2.6
N$12  (via drill 0.36)
  Top 0.305: IC2.5 v63.13,19.82 | J20.2 64.43,7.72 64.43,4.27 J19.2
  Bottom 0.305: v63.13,19.82 v63.13,19.81 62.48,19.16 62.48,14.89 64.46,12.91 J20.2
N$13
  Top 0.406: LED3.A 11.46,61.82 LED3-GRN.A 11.94,63.68 19.02,70.76 R2.7
N$14  (via drill 0.36)
  Top 0.305: IC2.6 v63.12,21.09 | J20.3 62.37,7.04 J19.3
  Bottom 0.305: v63.12,21.09 61.92,19.9 J20.3
N$15
  Top 0.406: LED4.A 11.46,45.08 LED4-WHT.A 11.93,47.53 16.93,52.53 16.93,67.32 R2.8
N$16  (via drill 0.36)
  Top 0.305: IC2.7 v63.09,22.36 | J20.4 60.37,6.76 J19.4
  Bottom 0.305: v63.09,22.36 63.09,22.11 59.38,18.4 J20.4
N$17
  Top 0.254: J9.14 U1.6
N$18  (via drill 0.36)
  Top 0.305: IC2.10 v53.47,22.36 | J20.6 54.64,7.75 56.37,6.02 J19.6
  Bottom 0.305: v53.47,22.36 53.47,21.81 54.3,20.98 J20.6
N$19
  Top 0.305: IC1.2 65.69,85.48 87.63,63.54
  Top 0.406: 87.63,63.54 87.63,59.73 91.48,55.88 VR1.2 94.02,55.92 R5.2
N$20
  Top 0.254: J9.13 U1.7
N$21
  Top 0.254: J9.16 U1.4
N$22
  Top 0.254: J9.17 U1.3
N$23
  Top 0.254: J9.7 U1.13
N$24
  Top 0.254: J9.4 U1.16
N$25
  Top 0.254: J9.3 U1.17
N$26
  Top 0.254: J9.2 U1.18
RT1
  Top 0.406: R7.2 82.2,29.89 IC3.4
SCK  (via drill 0.35)
  Top 0.305: R6.7 5.99,24.88 6.42,25.31 7.37,25.31 7.72,24.96 7.72,17.7 7.17,17.15 J17.SCLK 7.18,17.15 v7.47,17.44 | J5.3 54.18,90.64 55.92,90.64 56.95,89.62 56.95,88.33 67.74,77.54 67.74,65.24 v67.31,64.81
  Bottom 0.305: v7.47,17.44 8.91,15.99 35,15.99 45.72,26.71 | U1.28 45.72,26.71 | 45.72,26.71 48.26,26.71 59.69,38.14 59.69,55.92 67.31,63.54 v67.31,64.81
SCL  (via drill 0.35)
  Top 0.305: R13.1 51.51,36.87 U1.22 44.63,41.58 44.63,34.59 45.39,33.84 45.91,33.84 47.9,31.85 47.9,29.98 52.45,25.44 v53.34,25.44 | RTC1.8 52.09,51.65 v52.09,47.06 | IC2.14 53.88,17.28 v53.34,17.82
  Top 0.406: RTC1.8 54.19,55.08 v46.99,62.27
  Bottom 0.305: v52.09,47.06 47.7,42.66 U1.22 | J14.4 15.24,110.36 J13.4 15.29,111.85 16.51,113.07 26.67,113.07 J12.4 31.75,110.46 | 31.75,110.46 31.75,111.8 33.02,113.07 43.18,113.07 J10.4 48.26,110.36 J8.4 | 31.75,110.46 J11.4 | v53.34,17.82 52.83,18.33 52.83,24.93 v53.34,25.44
  Bottom 0.406: J10.4 46.99,106.72 v46.99,62.27
SD
  Top 0.305: R1.2 67.63,88.13 66.69,89.07 IC1.4
SDA  (via drill 0.35)
  Top 0.305: U1.25 46.29,35.04 48.27,33.06 R12.1 55.21,31.5 52.07,28.36 v52.07,26.71 | RTC1.7 54.79,53.07 54.79,53.01 53.34,51.56 v53.34,47.03 | J10.3 50.02,107.99 48.44,106.42 36.18,106.42 34.6,107.99 J12.3 | IC2.15 53.88,16.01 v53.34,16.55
  Top 0.406: RTC1.7 55.46,55.08 v48.26,62.27
  Bottom 0.305: v53.34,47.03 48.07,41.77 48.07,37.4 U1.25 | J13.3 J14.3 17.78,106.75 32.27,106.75 33.51,107.99 J12.3 J11.3 34.62,110.74 | v53.34,16.55 53.34,16.93 52.37,17.89 52.37,26.41 v52.07,26.71 | J10.3 J8.3
  Bottom 0.406: v48.26,62.27 47.62,62.91 47.62,104.82 J10.3
SQW
  Top 0.305: RTC1.3 56.73,44.8 R4.1 56.94,42.26 58.68,40.52 58.68,15.84 56.87,14.03 50.11,14.03 U1.35
SS1  (1 unrouted)
  Top 0.406: 82.88,21 83.64,21.76 IC3.6
SW1
  pour Top (no thermals): 86.1,23.28 86.1,26.02 94.84,26.02 94.84,20.05 91.23,20.05 91.23,24.11 88.74,24.11 85.24,20.61 83.36,20.61 83.36,23.28
VIN1  (1 unrouted)
  Top 1.27: 78.74,2.71 J18.1B J18.1A 78.15,8.93 75.38,11.71 75.38,28.6 79.33,32.55 C7.1 | 86.58,3.91 J16.1 86.13,3.96 85.62,4.47 80.63,4.47 78.74,2.58
  Top 2.54: J15.2 38.1,91.48 44.45,97.83 57.15,97.83 59.21,95.77 59.21,88.94 74.93,73.22 74.93,11.47 77.47,8.93 78.15,8.93
  pour Top (no thermals): 85.14,33.36 83.66,33.36 83.46,33.44 83.46,29.14 85.14,29.14
WHT-LED  (via drill 0.35)
  Top 0.305: R2.1 19.3,68 19.3,56.18 v19.05,55.92 | v34.29,41.95 45.19,31.05 46.17,31.05 46.8,30.41 46.8,23.43 U1.30
  Bottom 0.305: v34.29,41.95 33.02,41.95 v19.05,55.92

### Text on the board
tPlace: I2C | I2C | I2C | Audio Out | IO14 | IO13 | 3V3 | + | + / - | SCL / SDA / 5V / GND | SCL / SDA / 5V / GND | SCL / SDA / 5V / GND | IO14 / 5V / GND | IO13 / 5V / GND | 5V DIRECT | 12-20V DC | GND 5V | GND + | CircuitSetup.us / Time Circuits Display / Control Board v1.1 | 5V | ESP32 | SCL | SCL | ENTER | 12-20V DC | Keypad | + | P0 / P1 / P2 / P3 / P4 / P5 / P6
bPlace: + / - | SCL / SDA / 5V / GND | SCL / SDA / 5V / GND | SCL / SDA / 5V / GND | + / - | Audio Out | IO14 / 5V / GND | IO13 / 5V / GND | I2C | I2C | I2C | IO14 | IO13 | 5V DIRECT | 12-20V DC | + GND | 5V GND | CircuitSetup.us / Time Circuits Display / Control Board v1.1 | 3V3 | Keypad | P0 / P1 / P2 / P3 / P4 / P5 / P6 | 5V
tNames: SPI | GND / MOSI / 5V | RESET / SCK / MISO
bNames: SPI | GND / MOSI / 5V | RESET / SCK / MISO